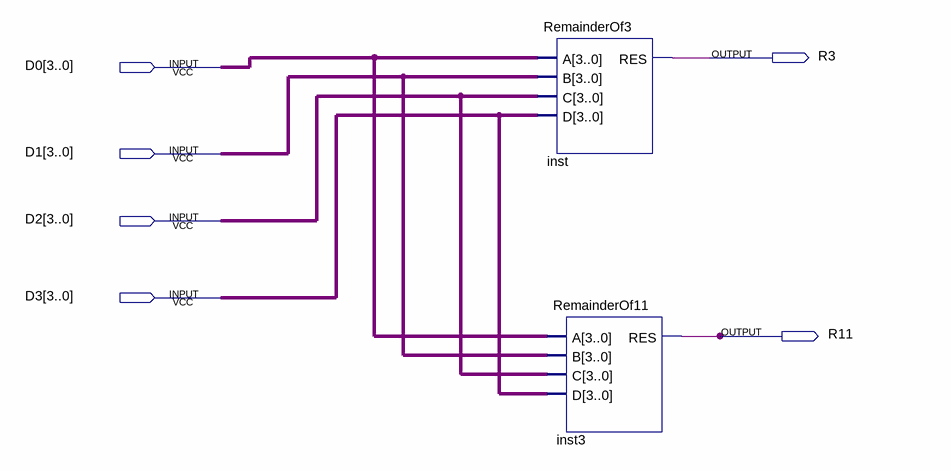
[diagram p0: schematic sheet]
// Quartus schematic Az1.bdf as structural Verilog: 2 symbols, 6 pins
module Az1 (
  input  [3:0] D0,
  input  [3:0] D1,
  input  [3:0] D2,
  input  [3:0] D3,
  output R3,
  output R11
);

  RemainderOf3 inst (.A(D0), .B(D1), .C(D2), .D(D3), .RES(R3));
  RemainderOf11 inst3 (.A(D0), .B(D1), .C(D2), .D(D3), .RES(R11));
endmodule
